# Altium schematic sheet inopto.SchDoc
size A4
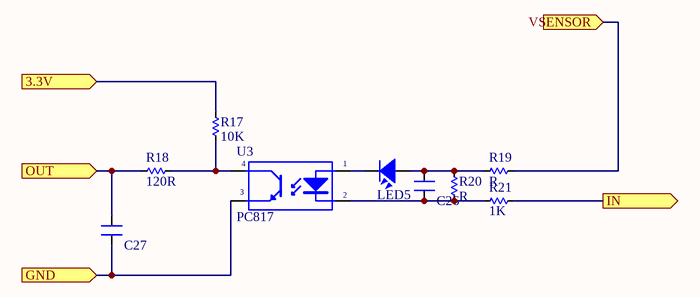
[diagram p0: inopto.SchDoc]

## Parts
C26  CN  [CN-SMD-0603_big]  (value not drawn)
C27  CN  [CN-SMD-0603_big]  (value not drawn)
LED5  MinZ  [LED-0805-Blue]  (value not drawn)
R17  10K  [RES-SMD-0603_BIG]
R18  120R  [RES-SMD-0603_BIG]
R19  R  [RES-SMD-0603_BIG]
R20  R  [RES-SMD-0603_BIG]
R21  1K  [RES-SMD-0603_BIG]
U3  PC817  [PC817SMT]

## Ports
3.3V (in), GND (in), IN (out), OUT (in), VSENSOR (in)

## Nets
3.3V: R17.1 ; port 3.3V
GND: C27.1 U3.3(E) ; port GND
IN: R21.1 ; port IN
OUT: C27.2 R18.1 ; port OUT
VSENSOR: R19.1 ; port VSENSOR
NetC26_1: C26.1 R20.2 R21.2 U3.2(K)
NetC26_2: C26.2 LED5.1 R19.2 R20.1
NetLED5_2: LED5.2 U3.1(A)
NetR17_2: R17.2 R18.2 U3.4(C)

## Library data of the parts
C26 C27 = CN: Value: 33pF
LED5 = LED SMD: Value: LED 3 - 5 ly 2 Colour
R17 R18 R21 = R
U3 = PC817: Single Opto; Value: PC817